# Altium schematic sheet mStpsch.SchDoc
size A
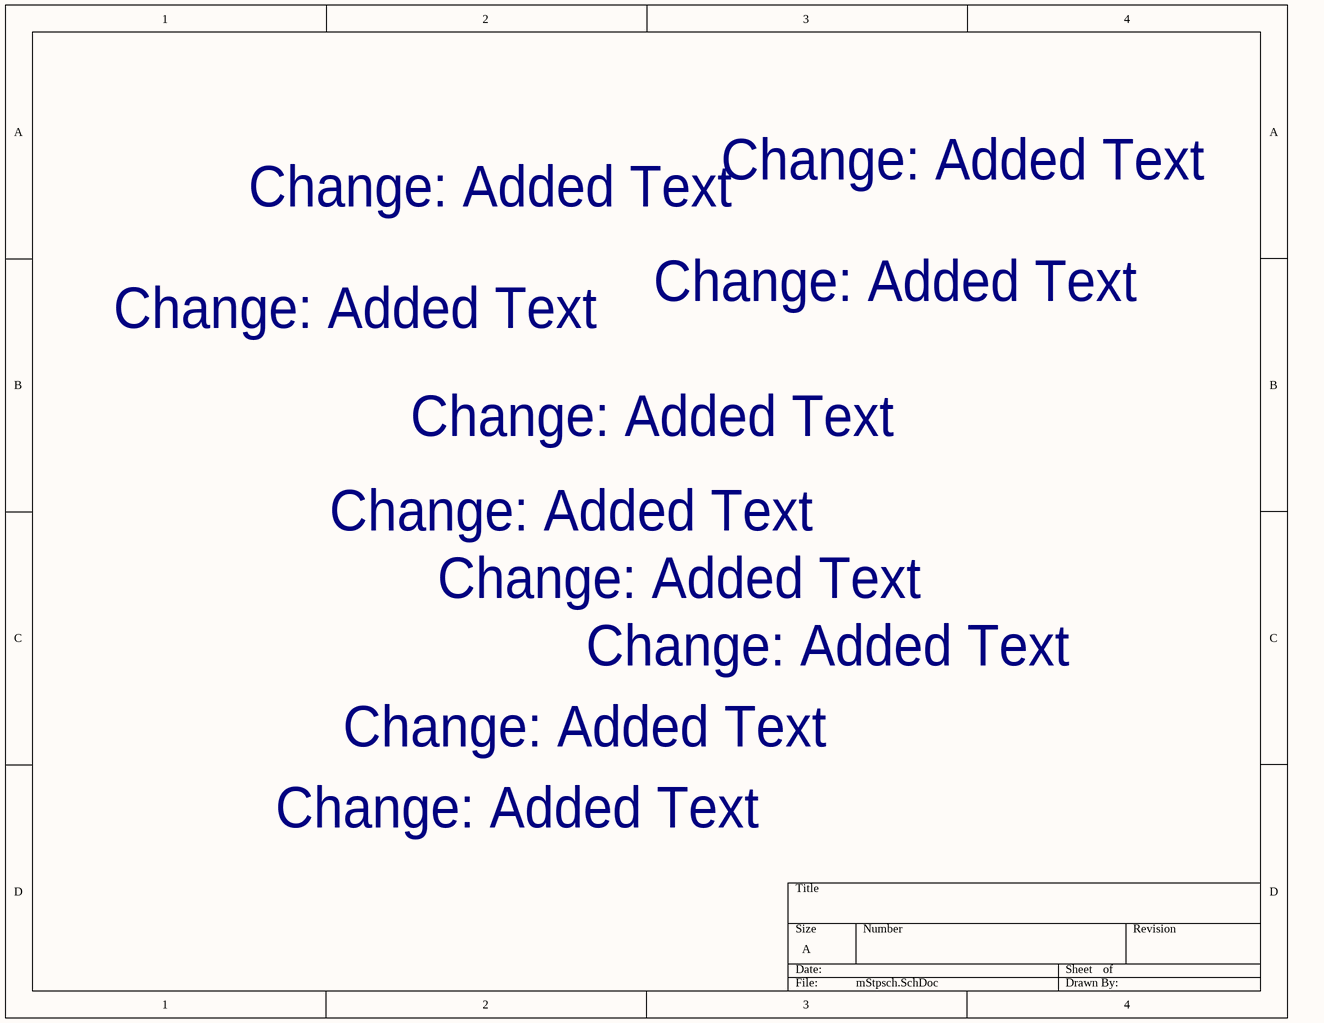
[diagram p0: mStpsch.SchDoc]

## Notes on the sheet
- Change: Added Text